# Altium schematic sheet Audio_Player_V1.1.SchDoc
size A; DrawnBy: Duc Huy Le; SheetNumber: 1; SheetTotal: 4
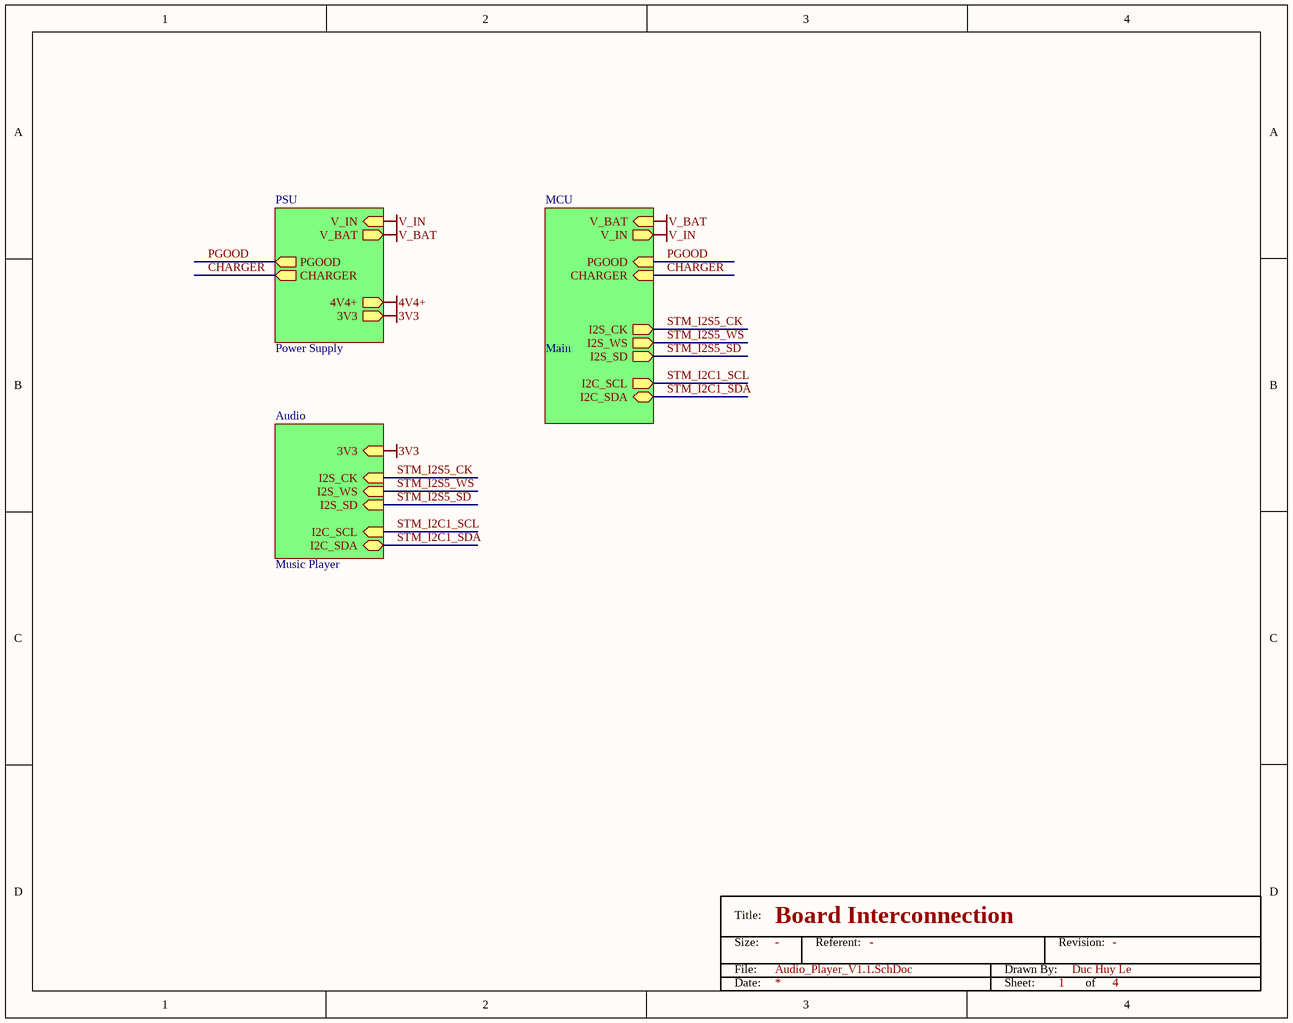
[diagram p0: Audio_Player_V1.1.SchDoc]

## Parts
TitleBlock1  Title: Board Interconnection  (hidden comment: Title Block)

## Sub-sheets
Main = MCU: V_IN (out), I2C_SCL (out), I2C_SDA (bidir), I2S_CK (out), I2S_WS (out), I2S_SD (out), V_BAT (in), PGOOD (in), CHARGER (in)
Music Player = Audio: 3V3 (in), I2S_CK (in), I2S_WS (in), I2S_SD (in), I2C_SCL (in), I2C_SDA (bidir)
Power Supply = PSU: V_IN (in), 4V4+ (out), 3V3 (out), V_BAT (out), PGOOD (out), CHARGER (out)

## Nets
3V3: sheet Power Supply/3V3, sheet Music Player/3V3
4V4+: sheet Power Supply/4V4+
V_BAT: sheet Power Supply/V_BAT, sheet Main/V_BAT
V_IN: sheet Power Supply/V_IN, sheet Main/V_IN
CHARGER: sheet Power Supply/CHARGER, sheet Main/CHARGER
PGOOD: sheet Power Supply/PGOOD, sheet Main/PGOOD
STM_I2C1_SCL: sheet Main/I2C_SCL, sheet Music Player/I2C_SCL
STM_I2C1_SDA: sheet Main/I2C_SDA, sheet Music Player/I2C_SDA
STM_I2S5_CK: sheet Main/I2S_CK, sheet Music Player/I2S_CK
STM_I2S5_SD: sheet Main/I2S_SD, sheet Music Player/I2S_SD
STM_I2S5_WS: sheet Main/I2S_WS, sheet Music Player/I2S_WS

## Notes on the sheet
- (in symbol Title Block) Title:; Size:; Referent:; Revision:; File:; Drawn By:; Date:; Sheet:; of

## Library data of the parts
TitleBlock1 = Title Block: Revision: -; Referent: -; Size: -